# Altium schematic sheet aLCD.SchDoc
size A4; SheetNumber: 7; SheetTotal: 8
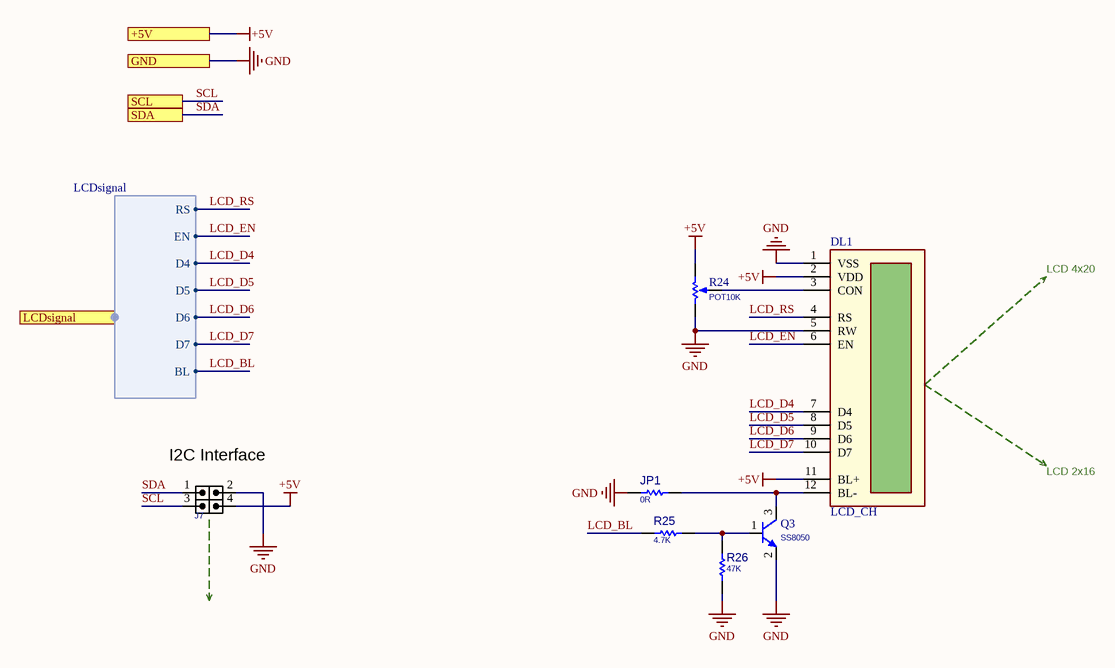
[diagram p0: aLCD.SchDoc]

## Parts
DL1  LCD_CH  [LCD_CH]
J7  HDRM_2X2  [HDR_M_2X2]  (value not drawn)
JP1  0R  [R0805]
Q3  SS8050  [SOT23_3]
R24  POT10K  [POT_7X5]
R25  4.7K  [R0805]
R26  47K  [R0805]

## Ports
+5V, GND, LCDsignal (harness LCDsignal), SCL, SDA

## Harnesses
LCDsignal: RS, EN, D4, D5, D6, D7, BL

## Nets
+5V: DL1.2(VDD) DL1.11(BL+) J7.4 R24.1(TOP) ; port +5V
GND: DL1.1(VSS) DL1.5(RW) J7.2 JP1.2 Q3.2(E) R24.3(BOT) R26.2 ; port GND
LCD_BL: R25.2 ; port LCDsignal.BL
LCD_D4: DL1.7(D4) ; port LCDsignal.D4
LCD_D5: DL1.8(D5) ; port LCDsignal.D5
LCD_D6: DL1.9(D6) ; port LCDsignal.D6
LCD_D7: DL1.10(D7) ; port LCDsignal.D7
LCD_EN: DL1.6(EN) ; port LCDsignal.EN
LCD_RS: DL1.4(RS) ; port LCDsignal.RS
SCL: J7.3 ; port SCL
SDA: J7.1 ; port SDA
NetDL1_3: DL1.3(CON) R24.2(TAP)
NetDL1_12: DL1.12(BL-) JP1.1 Q3.3(C)
NetQ3_1: Q3.1(B) R25.1 R26.1

## Notes on the sheet
- LCD 4x20
- (near J7) I2C Interface
- LCD 2x16

## Library data of the parts
DL1 = LCD_CH: alphanumeric lcd  2x16
J7 = HDR_M_2X2: CONN, HEADER, Male, pitch: 2.54mm, 4POS; MANF_P#: MANF_PART#; MANF: MANF; VALUE: HDRM_2X2
JP1 R25 R26 = RES_SMD_0805: RESISTOR, SMD; PARAM: -W; DESC: DESCRIPTION; DIST#: MOUSER; PARAM2: 1%; MANF_P#: -; MANF: -; ASSEMBLY: ASSEMBLY; PRICE: 100= 0.5$
  JP1: VALUE: 0R
  R25: VALUE: 4.7K
  R26: VALUE: 47K
Q3 = NPN_SS8050_SOT23: BJT, NPN, 25v, 1.5A, SMD, SOT23; PARAM2: 300mW; MANF: GALAXY; PARAM: 25v, 1.5A; MANF_P#: SS8050; VALUE: SS8050
R24 = RES_THD_POT_7X5: RESISTOR, THD, Potentiometer; VALUE: POT10K